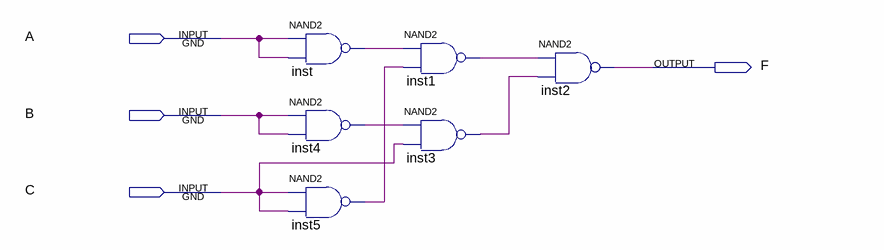
[diagram p0: schematic sheet]
// Quartus schematic tiv1_1.bdf as structural Verilog: 6 symbols, 4 pins
module tiv1_1 (
  input  A,
  input  B,
  input  C,
  output F
);

  wire inst1_out, inst3_out, inst4_out, inst5_out, inst_out;

  nand inst (inst_out, A, A);
  nand inst4 (inst4_out, B, B);
  nand inst5 (inst5_out, C, C);
  nand inst1 (inst1_out, inst_out, inst5_out);
  nand inst3 (inst3_out, inst4_out, C);
  nand inst2 (F, inst1_out, inst3_out);
endmodule
